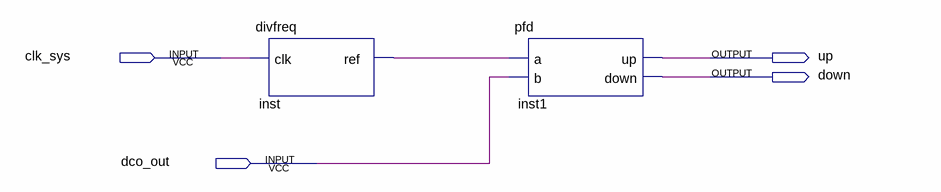
[diagram p0: schematic sheet]
// Quartus schematic adpll.bdf as structural Verilog: 2 symbols, 4 pins
module adpll (
  input  clk_sys,
  input  dco_out,
  output up,
  output down
);

  wire inst_ref;

  divfreq inst (.clk(clk_sys), .\ref (inst_ref));
  pfd inst1 (.a(inst_ref), .b(dco_out), .up(up), .down(down));
endmodule
